# Altium schematic sheet DIP(1).SchDoc
size A4
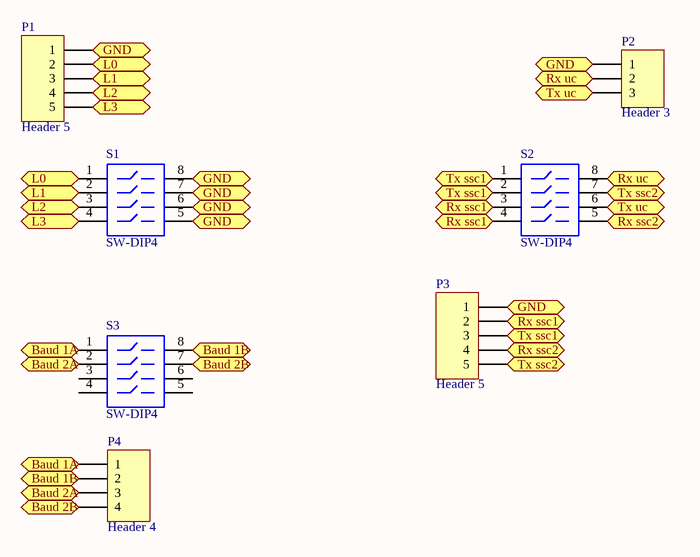
[diagram p0: DIP(1).SchDoc]

## Parts
P1  Header 5  [HDR1X5]
P2  Header 3  [HDR1X3]
P3  Header 5  [HDR1X5]
P4  Header 4  [HDR1X4]
S1  SW-DIP4  [DIP-8]
S2  SW-DIP4  [DIP-8]
S3  SW-DIP4  [DIP-8]

## Ports
Baud 1A, Baud 1B, Baud 2A, Baud 2B, GND, L0, L1, L2, L3, Rx ssc1, Rx ssc2, Rx uc, Tx ssc1, Tx ssc2, Tx uc

## Nets
Baud 1A: P4.1 S3.1 ; port Baud 1A
Baud 1B: P4.2 S3.8 ; port Baud 1B
Baud 2A: P4.3 S3.2 ; port Baud 2A
Baud 2B: P4.4 S3.7 ; port Baud 2B
GND: P1.1 P2.1 P3.1 S1.5 S1.6 S1.7 S1.8 ; port GND
L0: P1.2 S1.1 ; port L0
L1: P1.3 S1.2 ; port L1
L2: P1.4 S1.3 ; port L2
L3: P1.5 S1.4 ; port L3
Rx ssc1: P3.2 S2.3 S2.4 ; port Rx ssc1
Rx ssc2: P3.4 S2.5 ; port Rx ssc2
Rx uc: P2.2 S2.8 ; port Rx uc
Tx ssc1: P3.3 S2.1 S2.2 ; port Tx ssc1
Tx ssc2: P3.5 S2.7 ; port Tx ssc2
Tx uc: P2.3 S2.6 ; port Tx uc

Not connected (* = marked no-connect by the designer): S3 3 4 5 6

## Library data of the parts
P1 P3 = Header 5: Header, 5-Pin; LatestRevisionDate: 17-Jul-2002; LatestRevisionNote: Re-released for DXP Platform.; Publisher: Altium Limited
P2 = Header 3: Header, 3-Pin; LatestRevisionDate: 17-Jul-2002; LatestRevisionNote: Re-released for DXP Platform.; Publisher: Altium Limited
P4 = Header 4: Header, 4-Pin; LatestRevisionDate: 17-Jul-2002; LatestRevisionNote: Re-released for DXP Platform.; Publisher: Altium Limited
S1-S3 = SW-DIP4: DIP Switch; Published: 24-Mar-1999; LatestRevisionDate: 17-Jul-2002; LatestRevisionNote: Re-released for DXP Platform.; PackageReference: DIP-8; Publisher: Altium Limited